# Altium project ROV_PCB.PrjPcb
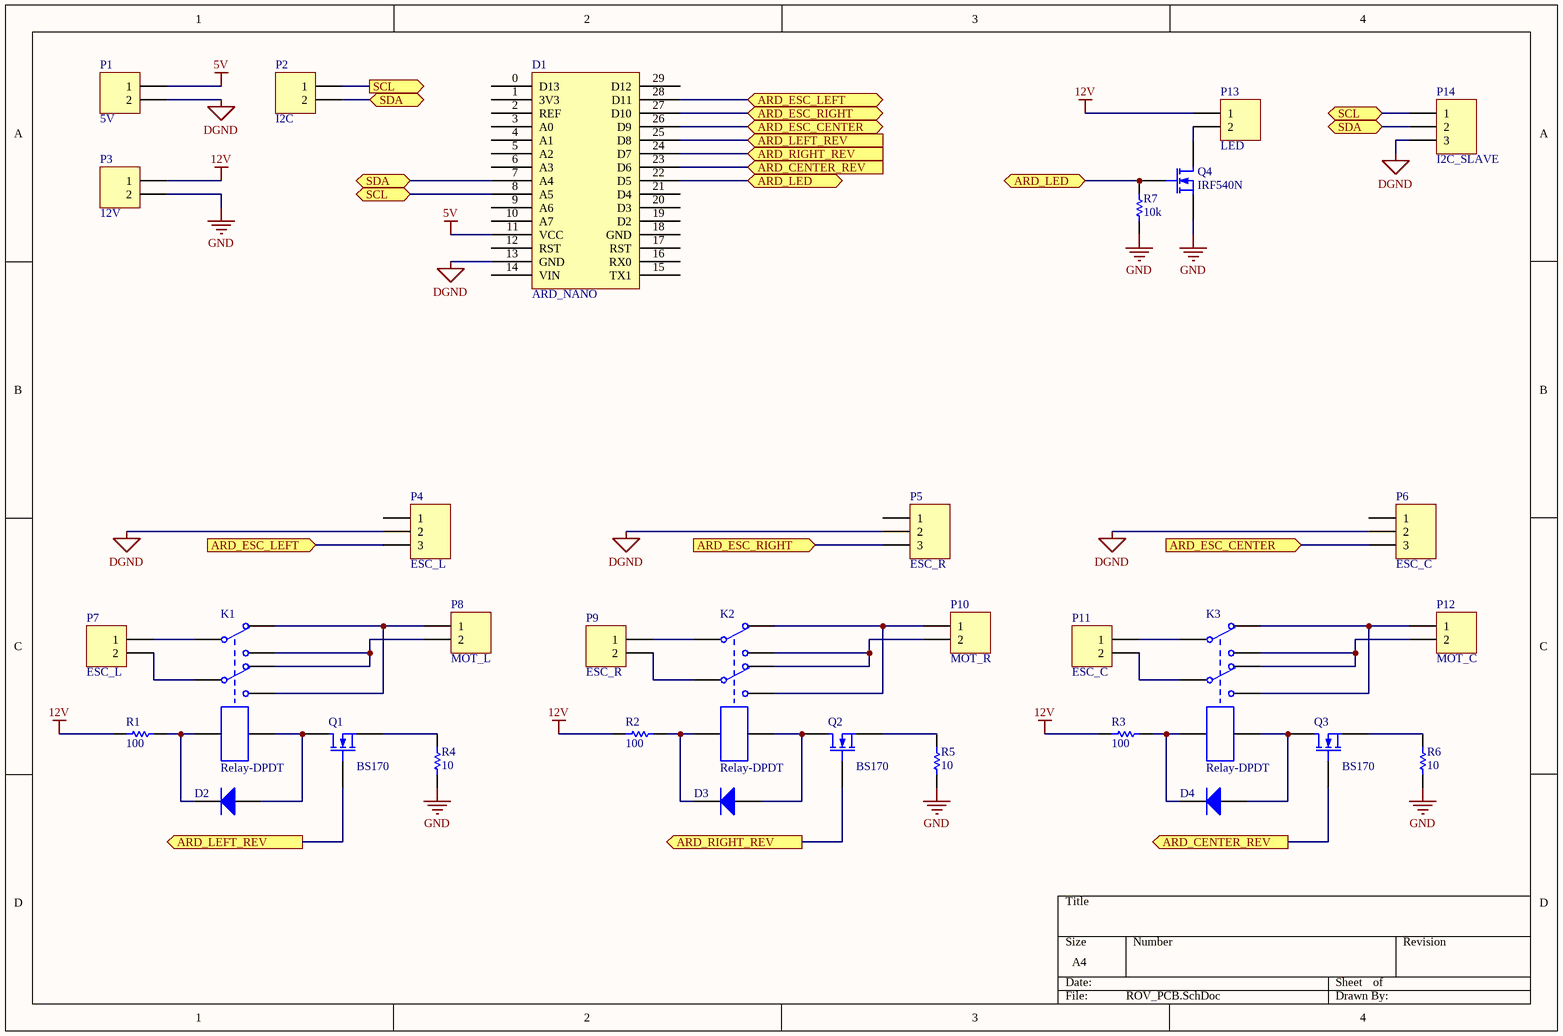
[diagram p0: ROV_PCB.SchDoc]
1 sheet, 32 parts. Net scope: flat (ports and power ports of the same name join across sheets).
Board file: ROV_PCB.PcbDoc

## Sheet ROV_PCB.SchDoc
size A4

### Parts
D1  ARD_NANO  [DIP30]
D2  Diode 1N4001  [DO-41]  (value not drawn)
D3  Diode 1N4001  [DO-41]  (value not drawn)
D4  Diode 1N4001  [DO-41]  (value not drawn)
K1  Relay-DPDT  [RELAY_CUSTOM]
K2  Relay-DPDT  [RELAY_CUSTOM]
K3  Relay-DPDT  [RELAY_CUSTOM]
P1  5V  [KLEMA]
P2  I2C  [HDR1X2]
P3  12V  [KLEMA]
P4  ESC_L  [HDR1X3]
P5  ESC_R  [HDR1X3]
P6  ESC_C  [HDR1X3]
P7  ESC_L  [KLEMA]
P8  MOT_L  [KLEMA]
P9  ESC_R  [KLEMA]
P10  MOT_R  [KLEMA]
P11  ESC_C  [KLEMA]
P12  MOT_C  [KLEMA]
P13  LED  [KLEMA]
P14  I2C_SLAVE  [HDR1X3]
Q1  BS170  [HDR1X3]
Q2  BS170  [HDR1X3]
Q3  BS170  [HDR1X3]
Q4  IRF540N  [HDR1X3]
R1  100  [AXIAL-0.5]
R2  100  [AXIAL-0.5]
R3  100  [AXIAL-0.5]
R4  10  [AXIAL-0.5]
R5  10  [AXIAL-0.5]
R6  10  [AXIAL-0.5]
R7  10k  [AXIAL-0.4]

### Ports
ARD_CENTER_REV (in), ARD_CENTER_REV (out), ARD_ESC_CENTER, ARD_ESC_CENTER (in), ARD_ESC_LEFT, ARD_ESC_LEFT (in), ARD_ESC_RIGHT, ARD_ESC_RIGHT (in), ARD_LED, ARD_LEFT_REV (in), ARD_LEFT_REV (out), ARD_RIGHT_REV (in), ARD_RIGHT_REV (out), SCL, SCL (out), SDA, SDA (bidir)

### Nets
5V: D1.11(VCC) P1.1
12V: P3.1 P13.1 R1.2 R2.2 R3.2
DGND: D1.13(GND) P1.2 P4.2 P5.2 P6.2 P14.3
GND: P3.2 Q4.3(S) R4.1 R5.1 R6.1 R7.2
NetD1_7: D1.7(A4) P2.2 P14.2 ; port SDA
NetD1_8: D1.8(A5) P2.1 P14.1 ; port SCL
NetD1_22: D1.22(D5) Q4.2(G) R7.1 ; port ARD_LED
NetD1_23: D1.23(D6) Q3.2(G) ; port ARD_CENTER_REV
NetD1_24: D1.24(D7) Q2.2(G) ; port ARD_RIGHT_REV
NetD1_25: D1.25(D8) Q1.2(G) ; port ARD_LEFT_REV
NetD1_26: D1.26(D9) P6.3 ; port ARD_ESC_CENTER
NetD1_27: D1.27(D10) P5.3 ; port ARD_ESC_RIGHT
NetD1_28: D1.28(D11) P4.3 ; port ARD_ESC_LEFT
NetD2_1: D2.1(A) K1.8 Q1.1(D)
NetD2_2: D2.2(K) K1.7 R1.1
NetD3_1: D3.1(A) K2.8 Q2.1(D)
NetD3_2: D3.2(K) K2.7 R2.1
NetD4_1: D4.1(A) K3.8 Q3.1(D)
NetD4_2: D4.2(K) K3.7 R3.1
NetK1_1: K1.1 P7.1
NetK1_2: K1.2 K1.6 P8.1
NetK1_3: K1.3 K1.5 P8.2
NetK1_4: K1.4 P7.2
NetK2_1: K2.1 P9.1
NetK2_2: K2.2 K2.6 P10.1
NetK2_3: K2.3 K2.5 P10.2
NetK2_4: K2.4 P9.2
NetK3_1: K3.1 P11.1
NetK3_2: K3.2 K3.6 P12.1
NetK3_3: K3.3 K3.5 P12.2
NetK3_4: K3.4 P11.2
NetP13_2: P13.2 Q4.1(D)
NetQ1_3: Q1.3(S) R4.2
NetQ2_3: Q2.3(S) R5.2
NetQ3_3: Q3.3(S) R6.2

Not connected (* = marked no-connect by the designer): D1 0(D13) 1(3V3) 2(REF) 3(A0) 4(A1) 5(A2) 6(A3) 9(A6) 10(A7) 12(RST) 14(VIN) 15(TX1) 16(RX0) 17(RST) 18(GND) 19(D2) 20(D3) 21(D4) 29(D12); P4 1; P5 1; P6 1

### Library data of the parts
D2-D4 = Diode 1N4001: 1 Amp General Purpose Rectifier; Published: 8-Jun-2000; LatestRevisionDate: 17-Jul-2002; LatestRevisionNote: Re-released for DXP Platform.; DatasheetVersion: 1998; PackageVersion: Aug-1999; PackageReference: DO-41; Publisher: Altium Limited; PackageDescription: Diode, Axial; Body 5.2 x 2.7 mm (LxDia. max), Lead Dia. 0.86 mm (max); Code_JEDEC: DO-204-AL; ComponentLink1Description: Manufacturer Link; ComponentLink1URL: http://www.fairchildsemi.com/; ComponentLink2Description: Datasheet; ComponentLink2URL: http://www.fairchildsemi.com/ds/1N%2F1N4001.pdf
K1-K3 = Relay-DPDT: Dual-Pole Dual-Throw Relay; Published: 24-Mar-1999; LatestRevisionDate: 17-Jul-2002; LatestRevisionNote: Re-released for DXP Platform.; PackageReference: DIP-P8; Publisher: Altium Limited; PackageDescription: Relay; 8 Leads
P1-P3 P7-P13 = Header 2: Header, 2-Pin; LatestRevisionDate: 17-Jul-2002; LatestRevisionNote: Re-released for DXP Platform.; Publisher: Altium Limited
P4-P6 P14 = Header 3: Header, 3-Pin; LatestRevisionDate: 17-Jul-2002; LatestRevisionNote: Re-released for DXP Platform.; Publisher: Altium Limited
Q1-Q4 = MOSFET-N: N-Channel MOSFET; Published: 8-Jun-2000; LatestRevisionDate: 17-Jul-2002; LatestRevisionNote: Re-released for DXP Platform.; PackageVersion: 1995/1996; PackageReference: E3; Publisher: Altium Limited; PackageDescription: TO, Flat Index; 3 In-Line, Axial Leads; Body Dia. 4.6mm; Lead Dia. 0.5 mm (max)
R1-R7 = Res1: Resistor; Value: 1K; Published: 8-Jun-2000; LatestRevisionDate: 17-Jul-2002; LatestRevisionNote: Re-released for DXP Platform.; PackageReference: AXIAL-0.3; Publisher: Altium Limited; PackageDescription: Axial Device, Thru-Hole; 2 Leads; 0.3 in Pin Spacing